# Altium schematic sheet Schematic.SchDoc
size A4
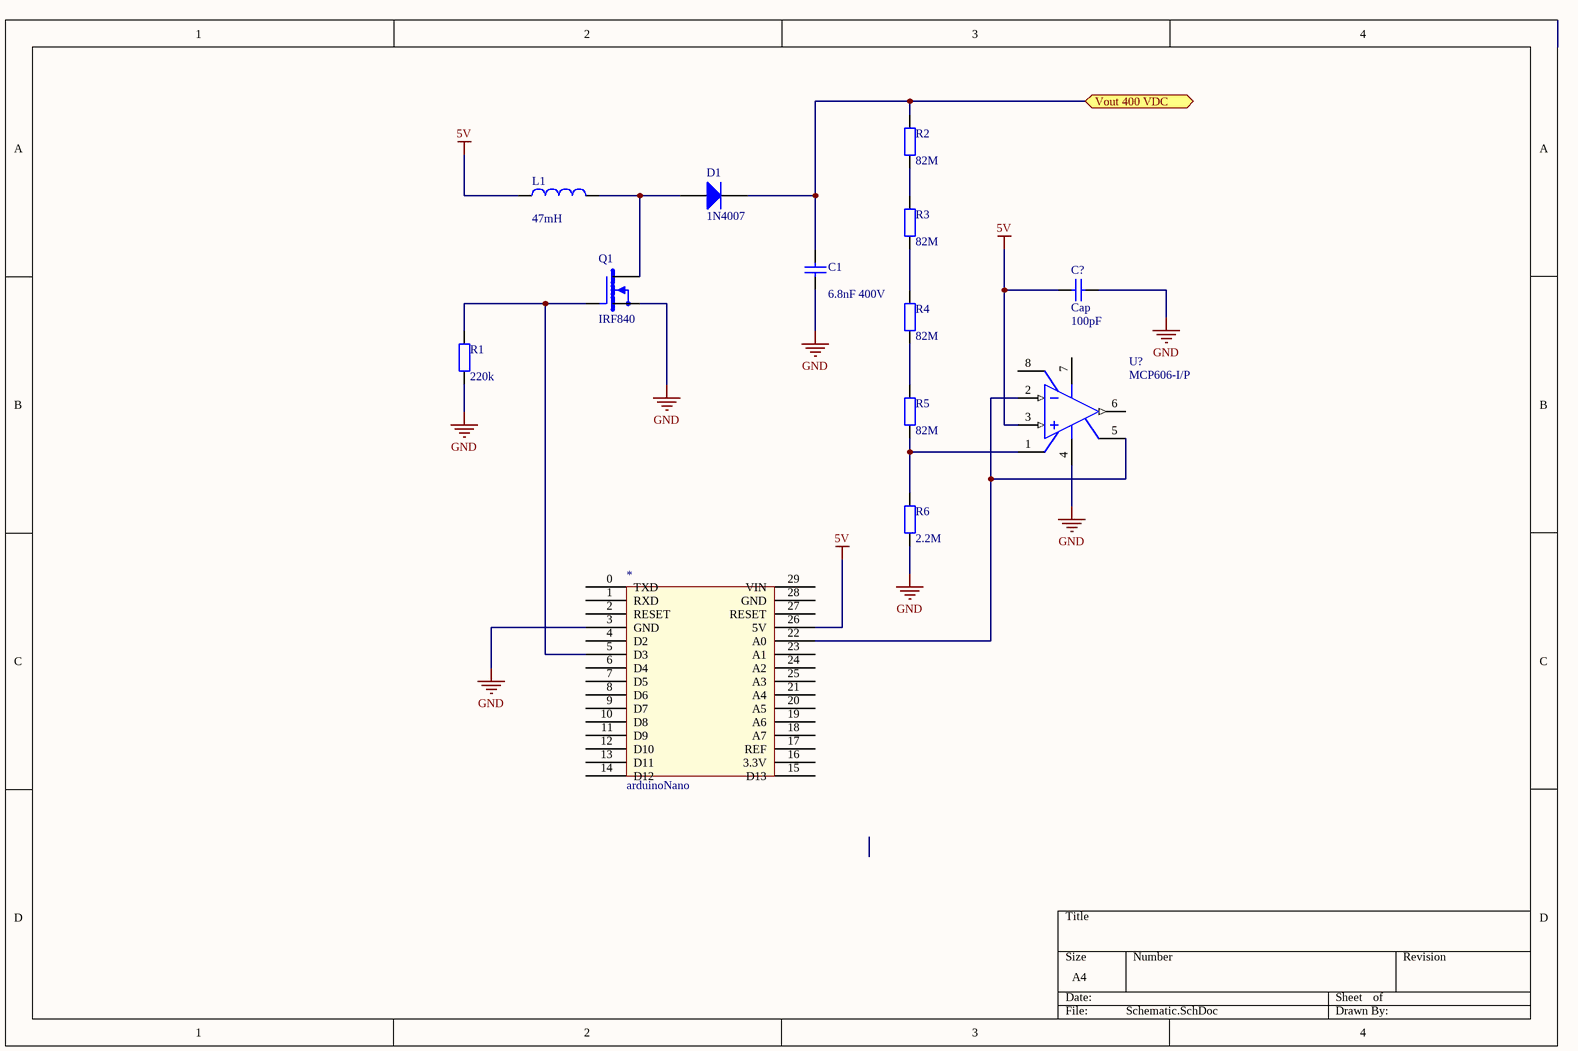
[diagram p0: Schematic.SchDoc]

## Parts
*  arduinoNano  [Arduino nano]
C1  value 6.8nF 400V  [RAD-0.3]
C?  Cap  value 100pF  [RAD-0.3]
D1  1N4007  [DO-41]
L1  value 47mH  [0402-A]
Q1  IRF840  [TO220]
R1  value 220k  [AXIAL-0.4]
R2  value 82M  [AXIAL-0.4]
R3  value 82M  [AXIAL-0.4]
R4  value 82M  [AXIAL-0.4]
R5  value 82M  [AXIAL-0.4]
R6  value 2.2M  [AXIAL-0.4]
U?  MCP606-I/P  [PDIP300-P8]

## Ports
Vout 400 VDC

## Nets
5V: *.26(5V) C?.1 L1.1 U?.3(VIN+)
GND: *.3(GND) C1.1 C?.2 Q1.3(S) R1.1 R6.1 U?.4(VSS)
Vout 400 VDC: C1.2 D1.2(K) R2.2 ; port Vout 400 VDC
Net*_5: *.5(D3) Q1.1(G) R1.2
Net*_22: *.22(A0) U?.2(VIN-) U?.5(NC)
NetD1_1: D1.1(A) L1.2 Q1.2(D)
NetR2_1: R2.1 R3.2
NetR3_1: R3.1 R4.2
NetR4_1: R4.1 R5.2
NetR5_1: R5.1 R6.2 U?.1(NC)

Not connected (* = marked no-connect by the designer): * 0(TXD) 1(RXD) 2(RESET) 4(D2) 6(D4) 7(D5) 8(D6) 9(D7) 10(D8) 11(D9) 12(D10) 13(D11) 14(D12) 15(D13) 16(3.3V) 17(REF) 18(A7) 19(A6) 20(A5) 21(A4) 23(A1) 24(A2) 25(A3) 27(RESET) 28(GND) 29(VIN); U? 6(VOUT) 7(VDD) 8(NC)

## Library data of the parts
C1 C? = Cap: Capacitor; Published: 8-Jun-2000; LatestRevisionDate: 17-Jul-2002; LatestRevisionNote: Re-released for DXP Platform.; PackageReference: RAD-0.3; Publisher: Altium Limited; PackageDescription: Radial Cap, Thru-Hole; 2 Leads; 0.3 in Pin Spacing
D1 = Diode 1N4007: 1 Amp General Purpose Rectifier; Published: 8-Jun-2000; LatestRevisionDate: 17-Jul-2002; LatestRevisionNote: Re-released for DXP Platform.; DatasheetVersion: 1998; PackageVersion: Aug-1999; PackageReference: DO-41; Publisher: Altium Limited; PackageDescription: Diode, Axial; Body 5.2 x 2.7 mm (LxDia. max), Lead Dia. 0.86 mm (max); Code_JEDEC: DO-204-AL; ComponentLink1Description: Manufacturer Link; ComponentLink1URL: http://www.fairchildsemi.com/; ComponentLink2Description: Datasheet; ComponentLink2URL: http://www.fairchildsemi.com/ds/1N%2F1N4001.pdf
L1 = Inductor: Code_IEC: 1005; Published: 8-Jun-2000; LatestRevisionDate: 29-May-2009; LatestRevisionNote: IPC-7351 Footprint Added.; PackageReference: 0402-A; Publisher: Altium Limited; PackageDescription: Chip Inductor; Code_JEITA: 0402
Q1 = IRF840: N-Channel 500V 8A _Tc_ 125W _Tc_ Through Hole TO-220AB; MF: Vishay Siliconix; MP: IRF840; SnapEDA_Link: https://www.snapeda.com/parts/IRF840/Vishay%20Siliconix/view-part/2782726/?ref=snap; Price: None; Package: TO-220 Intersil; Value: *; Availability: Unavailable
R1-R6 = Res2: Resistor; Published: 8-Jun-2000; LatestRevisionDate: 17-Jul-2002; LatestRevisionNote: Re-released for DXP Platform.; PackageReference: AXIAL-0.4; Publisher: Altium Limited; PackageDescription: Axial Device, Thru-Hole; 2 Leads; 0.4 in Pin Spacing
U? = MCP606-I/P: 2.5V to 6.0V Micropower CMOS Operational Amplifier, 8-Pin PDIP, Industrial Temperature; Published: 29-Jan-2009; LatestRevisionDate: 02-Dec-2009; LatestRevisionNote: Updated to datasheet revision F, Sep-2009; DatasheetVersion: revF, Sep-2009; PackageVersion: revBB, Aug-2009; PackageReference: PDIP300-P8; Publisher: Altium Limited; PackageDescription: 8-Lead Plastic Dual In-Line (P) - 300 mil Body [PDIP]; Supplier 1: Digi-Key; Supplier Part Number 1: MCP606-I/P-ND; Supplier 2: Farnell; Supplier Part Number 2: 1332130; Code_JEDEC: MS-001; ComponentLink1Description: Datasheet; ComponentLink1URL: http://ww1.microchip.com/downloads/en/DeviceDoc/11177f.pdf; ComponentLink2Description: Packaging Specification; ComponentLink2URL: http://www.microchip.com/stellent/groups/techpub_sg/documents/packagingspec/en012702.pdf; ComponentLink3Description: Microchip.com Home; ComponentLink3URL: http://www.microchip.com/